# EAGLE design IO_Top_BOARD (EAGLE 9.6.2)
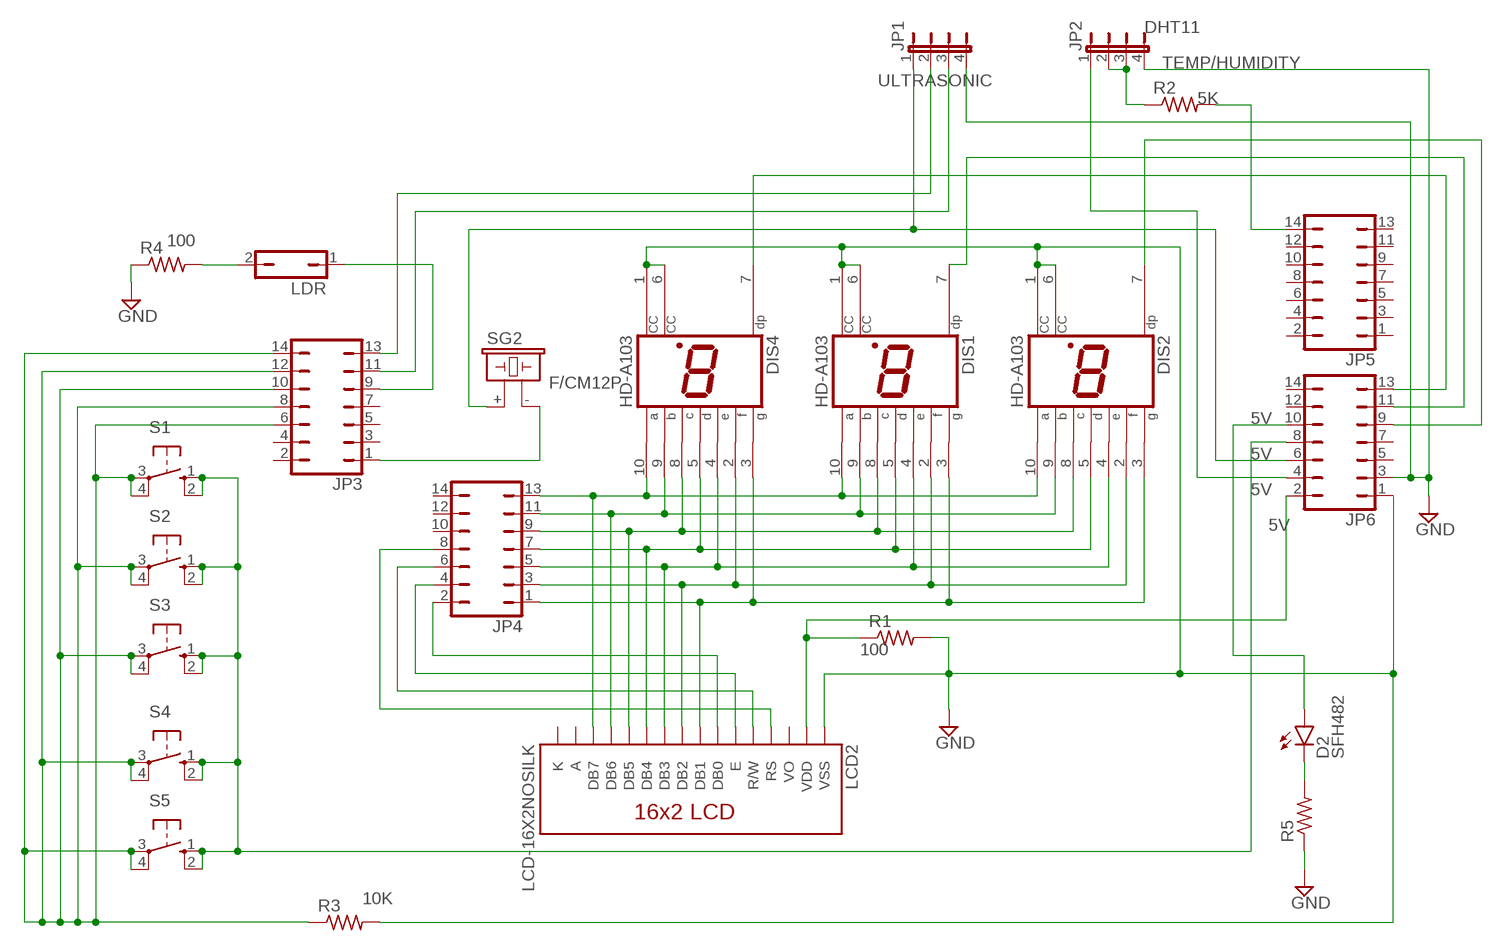
[diagram p0: schematic, sheet 1]

## Parts
D2  SFH482  [SFH482]
DIS1  HD-A103  [HDSP-A]
DIS2  HD-A103  [HDSP-A]
DIS4  HD-A103  [HDSP-A]
JP1  JP4E  [JP4]
JP2  JP4E  [JP4]
JP3  JP7Q  [JP7Q]
JP4  JP7Q  [JP7Q]
JP5  JP7Q  [JP7Q]
JP6  JP7Q  [JP7Q]
LCD2  LCD-16X2NOSILK  [LCD-16X2_NOSILK]
LDR  JP1Q  [JP1]
R1  R-US_0204/2V  [0204V]
R2  R-US_0204/2V  [0204V]
R3  R-US_0204/2V  [0204V]
R4  R-US_0204/2V  [0204V]
R5  R-US_0204/2V  [0204V]
S1  10-XX  [B3F-10XX]
S2  10-XX  [B3F-10XX]
S3  10-XX  [B3F-10XX]
S4  10-XX  [B3F-10XX]
S5  10-XX  [B3F-10XX]
SG2  F/CM12P  [F/CM12P]

## Nets
5V: JP1.1 JP6.6 SG2.+
GND: DIS1.1(CC) DIS1.6(CC) DIS2.1(CC) DIS2.6(CC) DIS4.1(CC) DIS4.6(CC) JP1.4 JP2.4 JP6.1 JP6.3 LCD2.1(VSS) R1.2 R3.2 R4.1 R5.1
N$1: JP3.1 SG2.-
N$2: JP2.2 JP2.3 R2.1
N$3: DIS1.3(G) DIS2.3(G) DIS4.3(G) JP4.1 LCD2.8(DB1)
N$4: DIS1.2(F) DIS2.2(F) DIS4.2(F) JP4.3 LCD2.9(DB2)
N$5: DIS1.4(E) DIS2.4(E) DIS4.4(E) JP4.5 LCD2.10(DB3)
N$6: DIS1.5(D) DIS2.5(D) DIS4.5(D) JP4.7 LCD2.11(DB4)
N$7: DIS1.8(C) DIS2.8(C) DIS4.8(C) JP4.9 LCD2.12(DB5)
N$8: DIS1.9(B) DIS2.9(B) DIS4.9(B) JP4.11 LCD2.13(DB6)
N$9: DIS1.10(A) DIS2.10(A) DIS4.10(A) JP4.13 LCD2.14(DB7)
N$10: JP4.2 LCD2.7(DB0)
N$11: JP6.2 LCD2.2(VDD) R1.1
N$12: JP1.3 JP3.11
N$13: JP4.4 LCD2.6(E)
N$14: JP4.6 LCD2.5(R/W)
N$15: JP4.8 LCD2.4(RS)
N$16: JP3.6 JP3.8 JP3.10 JP3.12 JP3.14 R3.1 S1.3(P) S1.4(P1) S2.3(P) S2.4(P1) S3.3(P) S3.4(P1) S4.3(P) S4.4(P1) S5.3(P) S5.4(P1)
N$17: JP1.2 JP3.13
N$18: JP5.14 R2.2
N$19: JP3.9 LDR.1
N$20: LDR.2 R4.2
N$21: JP2.1 JP6.4
N$22: JP6.8 S1.1(S) S1.2(S1) S2.1(S) S2.2(S1) S3.1(S) S3.2(S1) S4.1(S) S4.2(S1) S5.1(S) S5.2(S1)
N$23: D2.K(C) R5.2
N$24: D2.A JP6.10
N$25: DIS4.7(DP) JP6.13
N$26: DIS1.7(DP) JP6.11
N$27: DIS2.7(DP) JP6.9
Unconnected: JP3.2 JP3.3 JP3.4 JP3.5 JP3.7 JP4.10 JP4.12 JP4.14 JP5.1 JP5.2 JP5.3 JP5.4 JP5.5 JP5.6 JP5.7 JP5.8 JP5.9 JP5.10 JP5.11 JP5.12 JP5.13 JP6.5 JP6.7 JP6.12 JP6.14 LCD2.3(VO)

## Notes on the sheet
- DHT11
- TEMP/HUMIDITY
- ULTRASONIC
- 5K
- 100
- 100
- 10K

## Power pins joined to a net without a drawn wire
A: LCD2.15(A)
K: LCD2.16(K)

## Library data of the parts
D2 = led:SFH482: IR LED infrared emitting diode, Infineon
DIS1 DIS2 DIS4 = display-hp:HD-A103: LED DISPLAY 1-character 7 segment, decimal point right; OC_FARNELL: unknown; OC_NEWARK: unknown
JP1 JP2 = jumper:JP4E: JUMPER
JP3-JP6 = jumper:JP7Q: JUMPER
LCD2 = SparkFun-Displays:LCD-16X2: Standard text-only 16x2 parallel input LCD Basic 16 character by 2 line display. Typically utilizes the extremely common HD44780 parallel interface chipset SparkFun Products: Basic 16x2 Green <https://www.sparkfun.com/products/255> Basic 8x2 Green <https://www.sparkfun.com/products/11122>; SF_ID: LCD-00255
LDR = jumper:JP1Q: JUMPER
R1-R5 = rcl:R-US_: RESISTOR, American symbol; SPICEPREFIX: R
S1-S5 = switch-omron:10-XX: OMRON SWITCH; MPN: B3F-1000; OC_FARNELL: 176432; OC_NEWARK: 36M3542
SG2 = buzzer:F/CM12P: BUZZER Source: Buerklin; OC_FARNELL: unknown; OC_NEWARK: unknown

## Board
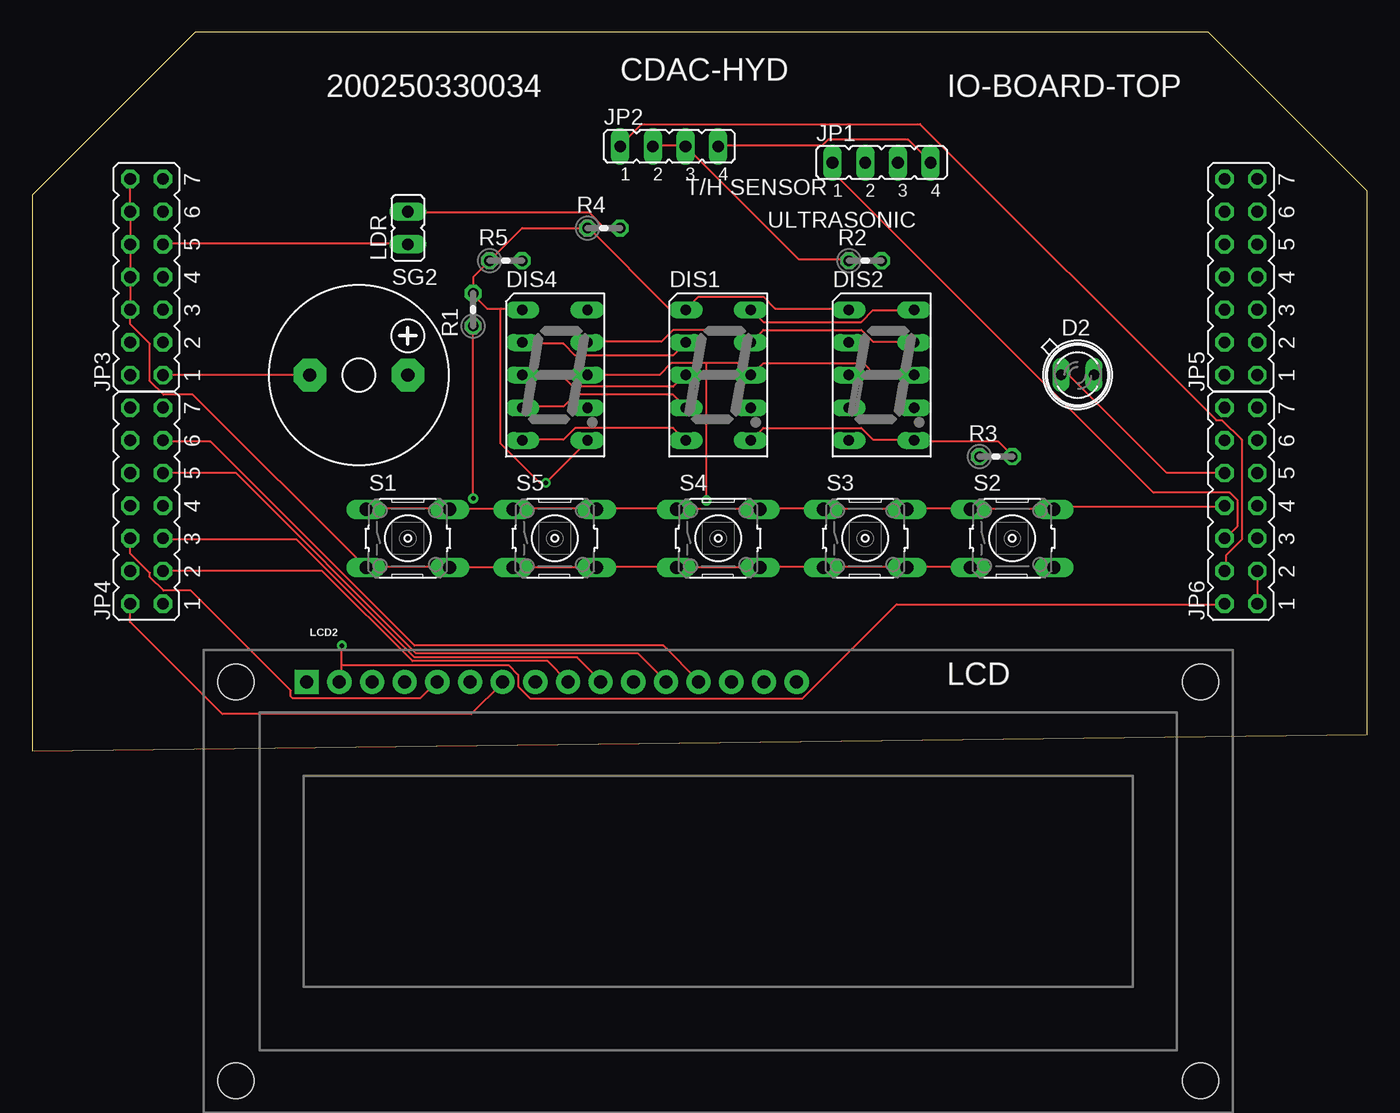
[diagram p1: board, top side]
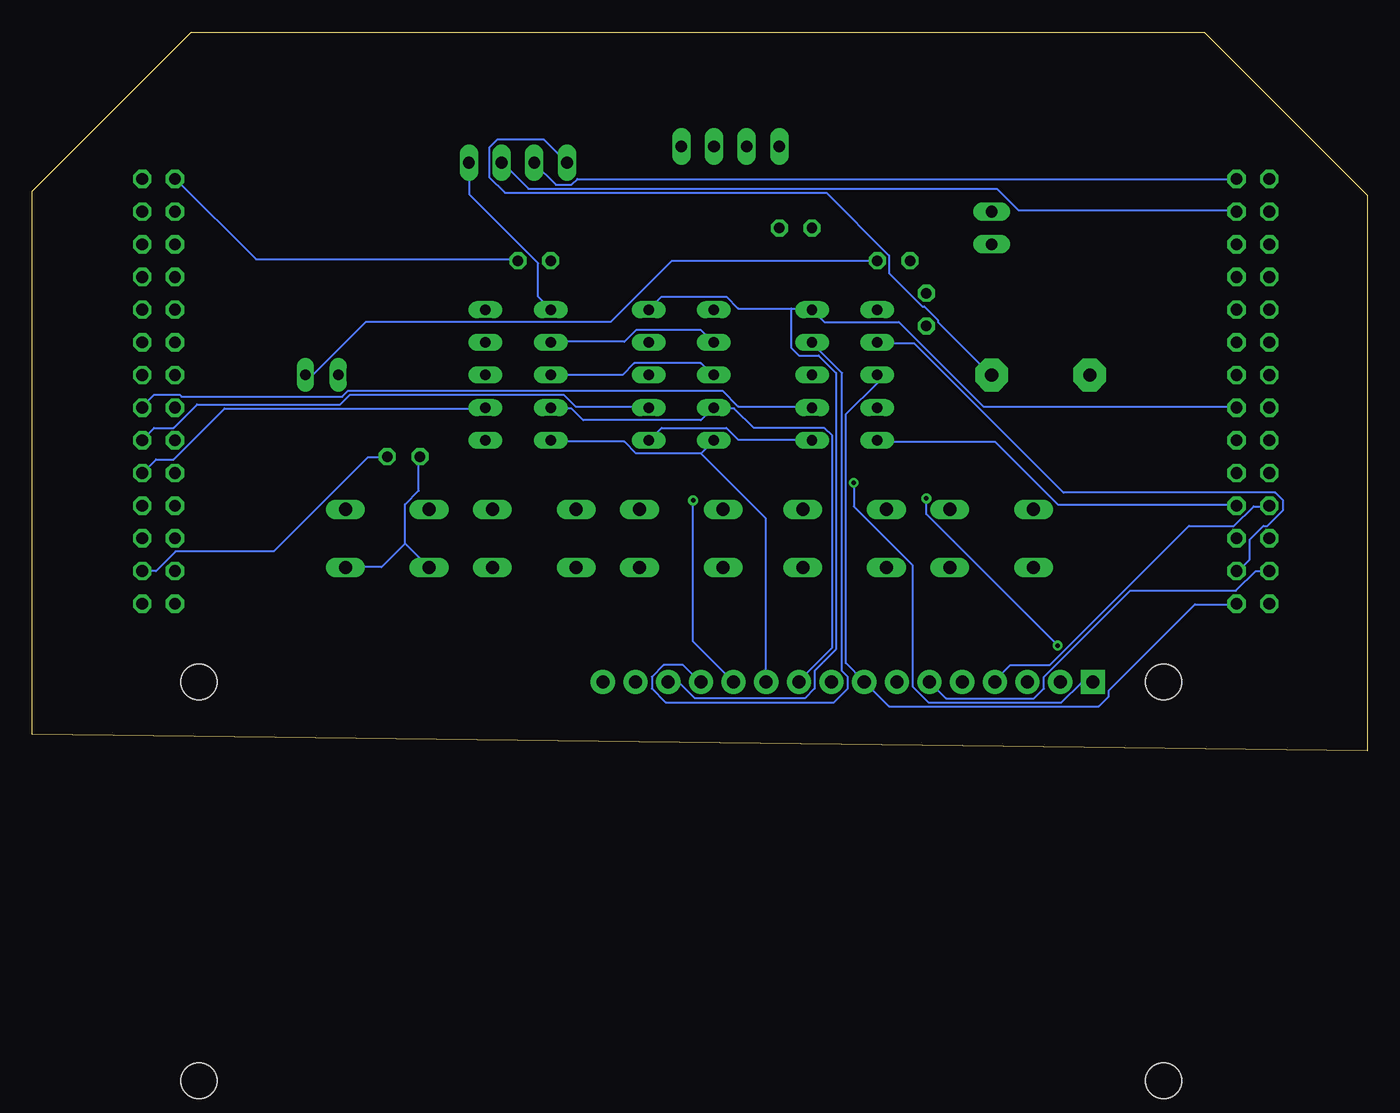
[diagram p2: board, bottom side, seen from below]

Size 103.81 x 55.87 mm. Coordinates in mm from the lower left corner, seen from the top.
Outline: 0,0 103.81,1.27 103.81,43.51 91.45,55.87 12.69,55.87 0,43.18 0,0
Copper layers (1*16): Top 0.035mm / dielectric 1.5mm / Bottom 0.035mm
Design rules "default": minimum track width 6mil, minimum drill 0.35mm, track to track 6mil, track to pad 6mil, pad to pad 6mil, via to via 6mil, smd to smd 6mil, copper to edge 40mil, drill to drill 6mil, minimum pad ring 10mil, minimum via ring 8mil, stop-mask expansion 4mil, vias tented up to drill 0mil, thermal gap 10mil

### Footprints (pad centres in the part's own frame; a part is rotated, then mirrored left to right if it is on the bottom)
SFH482 = drill 0.813 long: A -1.27,0; K 1.27,0
HDSP-A = drill 0.813 long: 1 -2.54,5.08; 2 -2.54,2.54; 3 -2.54,0; 4 -2.54,-2.54; 5 -2.54,-5.08; 6 2.54,-5.08; 7 2.54,-2.54; 8 2.54,0; 9 2.54,2.54; 10 2.54,5.08
JP4 = drill 0.914 long: 1 -3.81,0; 2 -1.27,0; 3 1.27,0; 4 3.81,0
JP7Q = drill 0.914 octagon: 1 -7.62,-1.27; 2 -7.62,1.27; 3 -5.08,-1.27; 4 -5.08,1.27; 5 -2.54,-1.27; 6 -2.54,1.27; 7 0,-1.27; 8 0,1.27; 9 2.54,-1.27; 10 2.54,1.27; 11 5.08,-1.27; 12 5.08,1.27; 13 7.62,-1.27; 14 7.62,1.27
LCD-16X2_NOSILK = drill 1.016 pad 1.88 square: 1 -32,15.5 | drill 1.016 pad 1.88: 2 -29.46,15.5; 3 -26.92,15.5; 4 -24.38,15.5; 5 -21.84,15.5; 6 -19.3,15.5; 7 -16.76,15.5; 8 -14.22,15.5; 9 -11.68,15.5; 10 -9.14,15.5; 11 -6.6,15.5; 12 -4.06,15.5; 13 -1.52,15.5; 14 1.02,15.5; 15 3.56,15.5; 16 6.1,15.5 | hole 2.8: -37.5,15.5; -37.5,-15.5; 37.5,15.5; 37.5,-15.5
JP1 = drill 0.914 long: 1 0,-1.27; 2 0,1.27
0204V = drill 0.813 octagon: 1 -1.27,0; 2 1.27,0
B3F-10XX = drill 1.016 long: 1 -3.251,2.261; 2 3.251,2.261; 3 -3.251,-2.261; 4 3.251,-2.261
F/CM12P = drill 1.016 pad 2.54 octagon: + 3.81,0; - -3.81,0

### Placement (x,y rotation side)
D2  81.28,29.21 0 top
DIS1  53.34,29.21 0 top
DIS2  66.04,29.21 0 top
DIS4  40.64,29.21 0 top
JP1  66.04,45.72 0 top
JP2  49.53,46.99 0 top
JP3  8.89,36.83 90 top
JP4  8.89,19.05 90 top
JP5  93.98,36.83 90 top
JP6  93.98,19.05 90 top
LCD2  53.34,-10.16 0 top
LDR  29.21,40.64 0 top
R1  34.29,34.29 90 top
R2  64.77,38.1 0 top
R3  74.93,22.86 0 top
R4  44.45,40.64 0 top
R5  36.83,38.1 0 top
S1  29.21,16.51 0 top
S2  76.2,16.51 0 top
S3  64.77,16.51 0 top
S4  53.34,16.51 0 top
S5  40.64,16.51 0 top
SG2  25.4,29.21 0 top

### Tracks (layer width: path | path; a pad name or v marks a point on that pad's centre or on a via)
5V
  Top 0.152: JP1.1 62.33,45.67 62.33,44.91 87.17,20.07 93.12,20.07 93.73,19.46 93.73,17.48 92.81,16.56 JP6.6
  Bottom 0.152: JP1.1 64.01,47.5 67.67,47.5 68.28,46.89 68.28,44.6 67.06,43.38 42.06,43.38 37.19,38.51 37.19,37.13 34.59,34.54 34.44,34.54 33.38,33.48 33.38,33.33 29.26,29.21 SG2.+
GND  (via drill 0.35)
  Top 0.152: 36.42,34.39 35.36,34.39 34.29,35.46 R1.2 34.29,36.83 R5.1 38.1,40.64 R4.1 43.28,40.64 49.53,34.39 50.75,34.39 DIS1.1 51.82,35.31 56.84,35.31 57.76,34.39 63.4,34.39 DIS2.1 | 36.42,34.39 38.1,34.39 DIS4.1 | JP2.4 53.34,47.04 61.42,47.04 61.87,47.5 68.12,47.5 69.8,45.82 JP1.4 | JP6.3 JP6.1 | R3.2 76.2,22.96 75.13,24.03 68.58,24.03 DIS2.6 68.58,24.18 65.38,24.18 64.47,25.09 56.84,25.09 DIS1.6 | DIS4.6 43.13,24.03 v39.93,20.83 39.47,20.83 36.42,23.88 36.42,34.39
  Bottom 0.152: JP1.4 69.8,45.67 69.8,43.23 64.47,37.9 64.47,35.31 63.55,34.39 DIS2.1 | JP6.3 94.18,13.97 92.66,15.49 85.04,15.49 77.72,22.81 76.2,22.81 R3.2 | DIS4.6 43.28,24.18 48.92,24.18 49.84,25.09 54.86,25.09 55.78,24.18 DIS1.6 | v39.93,20.83 39.93,19 35.36,14.43 35.36,4.98 34.14,3.76 23.77,3.76 22.25,5.28 21.49,5.28 LCD2.1
N$1
  Top 0.152: SG2.- JP3.1
N$2
  Top 0.152: R2.1 63.4,38.2 59.59,38.2 JP2.3 50.75,47.04 48.31,47.04 JP2.2
N$3
  Top 0.152: DIS4.3 41.15,29.21 42.06,28.3 49.84,28.3 50.75,29.21 DIS1.3
  Bottom 0.152: DIS2.3 57.91,29.21 57,30.12 51.82,30.12 50.9,29.21 DIS1.3 | JP4.1 10.21,11.38 13.41,11.38 20.12,4.67 20.12,4.22 20.88,3.45 37.19,3.45 39.01,5.28 LCD2.8 39.17,5.44 40.54,6.81 40.54,26.16 38.1,28.6 DIS4.3
N$4
  Top 0.152: DIS4.2 38.1,31.65 41.3,31.65 42.22,30.73 49.84,30.73 50.75,31.65 DIS1.2 | JP4.3 22.55,13.97 29.57,6.96 40.08,6.96 41.6,5.44 LCD2.9
  Bottom 0.152: DIS2.2 63.4,31.8 57.76,31.8 56.84,32.71 51.82,32.71 50.9,31.8 DIS1.2 | DIS4.2 38.1,31.65 35.2,31.65 23.62,20.07 7.16,20.07 6.55,19.46 6.55,18.69 7.77,17.48 8.08,17.48 9.14,16.41 9.14,14.88 10.06,13.97 JP4.3
N$5
  Top 0.152: DIS4.4 38.1,26.77 41.3,26.77 42.22,27.69 49.84,27.69 50.75,26.77 DIS1.4 | JP4.5 10.21,16.41 20.57,16.41 29.72,7.26 42.37,7.26 44.2,5.44 LCD2.10
  Bottom 0.152: DIS2.4 63.4,26.62 61.87,26.62 60.96,25.7 51.82,25.7 50.9,26.62 DIS1.4 50.75,26.62 49.23,26.62 47.7,25.09 42.22,25.09 41.6,24.49 41.6,8.03 44.2,5.44 LCD2.10
N$6
  Top 0.152: DIS1.5 49.84,25.09 42.22,25.09 41.3,24.18 38.1,24.18 DIS4.5
  Bottom 0.152: 51.82,23.11 56.84,23.11 57.76,24.03 63.4,24.03 DIS2.5 | DIS1.5 51.82,23.11 | JP4.7 10.21,19.15 24.08,19.15 28.96,24.03 38.1,24.03 DIS4.5 | 51.82,23.11 46.79,18.09 46.79,5.44 LCD2.11
N$7  (via drill 0.35)
  Top 0.152: DIS4.8 48.77,29.21 49.68,30.12 52.43,30.12 | 52.43,30.12 54.86,30.12 55.78,29.21 DIS1.8 55.93,29.21 56.84,30.12 64.62,30.12 65.53,29.21 DIS2.8 | JP4.9 15.85,21.59 29.87,7.57 47.09,7.57 49.23,5.44 LCD2.12 | v52.43,19.46 52.43,30.12
  Bottom 0.152: v52.43,19.46 52.43,8.48 49.38,5.44 LCD2.12
N$8
  Top 0.152: DIS4.9 43.28,31.8 48.92,31.8 49.84,32.71 54.86,32.71 55.78,31.8 DIS1.9 56.84,32.71 64.47,32.71 65.38,31.8 68.58,31.8 DIS2.9 | JP4.11 10.21,24.03 13.87,24.03 29.72,8.18 49.07,8.18 51.82,5.44 LCD2.13
  Bottom 0.152: DIS4.9 43.13,31.65 40.84,29.36 40.84,6.2 40.39,5.74 40.39,4.83 41.45,3.76 54.56,3.76 55.63,4.83 55.63,5.74 54.71,6.66 53.19,6.66 51.97,5.44 LCD2.13
N$9
  Top 0.152: DIS1.10 56.84,33.33 64.47,33.33 65.38,34.24 68.58,34.24 DIS2.10
  Bottom 0.152: 44.81,34.39 48.92,34.39 49.84,35.31 54.86,35.31 DIS1.10 | 44.81,34.39 43.28,34.39 DIS4.10 42.22,33.33 36.42,33.33 29.87,26.77 10.21,26.77 JP4.13 | 44.81,34.39 44.81,31.34 44.2,30.73 42.67,30.73 41.3,29.36 41.3,7.87 42.98,6.2 42.98,4.83 43.74,4.06 52.27,4.06 53.49,5.28 54.25,5.28 LCD2.14
N$10
  Top 0.152: JP4.2 7.62,10.01 14.78,2.84 34.14,2.84 36.58,5.28 LCD2.7
N$11  (via drill 0.35)
  Top 0.152: v34.29,19.61 R1.1 | 24.08,6.66 24.08,5.59 23.93,5.44 LCD2.2 | 24.08,6.66 v24.08,8.18 | 24.08,6.66 37.03,6.66 37.8,5.89 37.8,4.98 38.71,4.06 59.89,4.06 67.21,11.38 92.66,11.38 JP6.2
  Bottom 0.152: v34.29,19.61 34.29,18.39 v24.08,8.18
N$12
  Bottom 0.152: JP3.11 10.21,42.01 27.13,42.01 28.8,43.69 65.23,43.69 67.21,45.67 JP1.3
N$13
  Bottom 0.152: JP4.4 8.69,13.97 10.21,12.45 18.44,12.45 25.15,5.74 25.15,4.83 25.91,4.06 32.77,4.06 33.98,5.28 LCD2.6
N$14
  Top 0.152: JP4.6 7.62,15.34 9.14,13.82 9.14,13.51 10.21,12.45 12.34,12.45 20.12,4.67 20.12,4.22 20.27,4.06 30.18,4.06 31.39,5.28 LCD2.5
N$15
  Bottom 0.152: JP4.8 7.62,19 8.84,19 10.36,17.48 13.87,17.48 24.69,6.66 27.74,6.66 28.96,5.44 LCD2.4
N$16
  Top 0.152: 43.89,14.27 49.99,14.27 S4.3 50.14,14.27 56.54,14.27 S4.4 56.69,14.27 61.42,14.27 S3.3 61.57,14.27 67.97,14.27 S3.4 68.12,14.27 72.85,14.27 S2.3 | JP3.14 JP3.12 JP3.10 JP3.8 JP3.6 7.62,33.17 9.14,31.65 9.14,28.75 10.21,27.69 12.5,27.69 25.91,14.27 S1.3 26.06,14.27 32.46,14.27 | 32.46,14.27 37.34,14.27 S5.3 37.49,14.27 43.89,14.27 | 32.46,14.27 S1.4 | 43.89,14.27 S5.4
  Bottom 0.152: 74.83,16.1 74.83,19.15 73.76,20.22 73.76,22.81 R3.1 | 74.83,16.1 73,14.27 S2.3 | 74.83,16.1 76.66,14.27 79.4,14.27 S2.4
N$17
  Bottom 0.152: JP3.13 61.42,44.45 61.87,43.99 63.09,43.99 64.77,45.67 JP1.2
N$18
  Bottom 0.152: R2.2 66.14,38.2 86.41,38.2 92.66,44.45 JP5.14
N$19
  Top 0.152: JP3.9 10.21,39.42 29.11,39.42 LDR.1
N$20
  Top 0.152: R4.2 44.5,40.64 43.28,41.86 29.26,41.86 LDR.2
N$21
  Top 0.152: JP6.4 92.81,13.97 92.81,15.19 94.03,16.41 94.03,24.18 92.51,25.7 92.05,25.7 69.04,48.72 47.4,48.72 45.72,47.04 JP2.1
N$22
  Top 0.152: JP6.8 92.66,19 79.7,19 79.55,18.85 S2.2 79.4,18.85 73,18.85 S2.1 72.85,18.85 68.12,18.85 S3.2 67.97,18.85 61.57,18.85 S3.1 61.42,18.85 56.69,18.85 S4.2 56.54,18.85 50.14,18.85 S4.1 49.99,18.85 43.89,18.85 | 32.46,18.85 26.06,18.85 S1.1 | 32.46,18.85 37.34,18.85 S5.1 37.49,18.85 43.89,18.85 | 32.46,18.85 S1.2 | 43.89,18.85 S5.2
N$23
  Bottom 0.152: D2.K 81.99,29.21 77.88,33.33 58.83,33.33 54.1,38.05 38.1,38.05 R5.2
N$24
  Top 0.152: D2.A 80.62,29.21 88.24,21.59 JP6.10
N$25
  Bottom 0.152: DIS4.7 43.28,26.77 48.92,26.77 50.14,27.99 79.25,27.99 79.7,27.53 92.2,27.53 92.35,27.69 94.34,27.69 95.25,26.77 JP6.13
N$26
  Bottom 0.152: DIS1.7 55.93,26.77 61.57,26.77 62.48,27.69 79.1,27.69 79.86,26.92 90.98,26.92 92.81,25.09 94.34,25.09 95.25,24.18 JP6.11
N$27
  Bottom 0.152: JP6.9 94.18,22.66 92.81,22.66 88.85,26.62 68.58,26.62 DIS2.7
(copper drawn outside any net)
  shapes: Top area x1

### Text on the board
tNames: CDAC-HYD | 200250330034 | IO-BOARD-TOP | T/H SENSOR | ULTRASONIC | LCD